# EAGLE schematic Schematic (EAGLE 7.4.0)
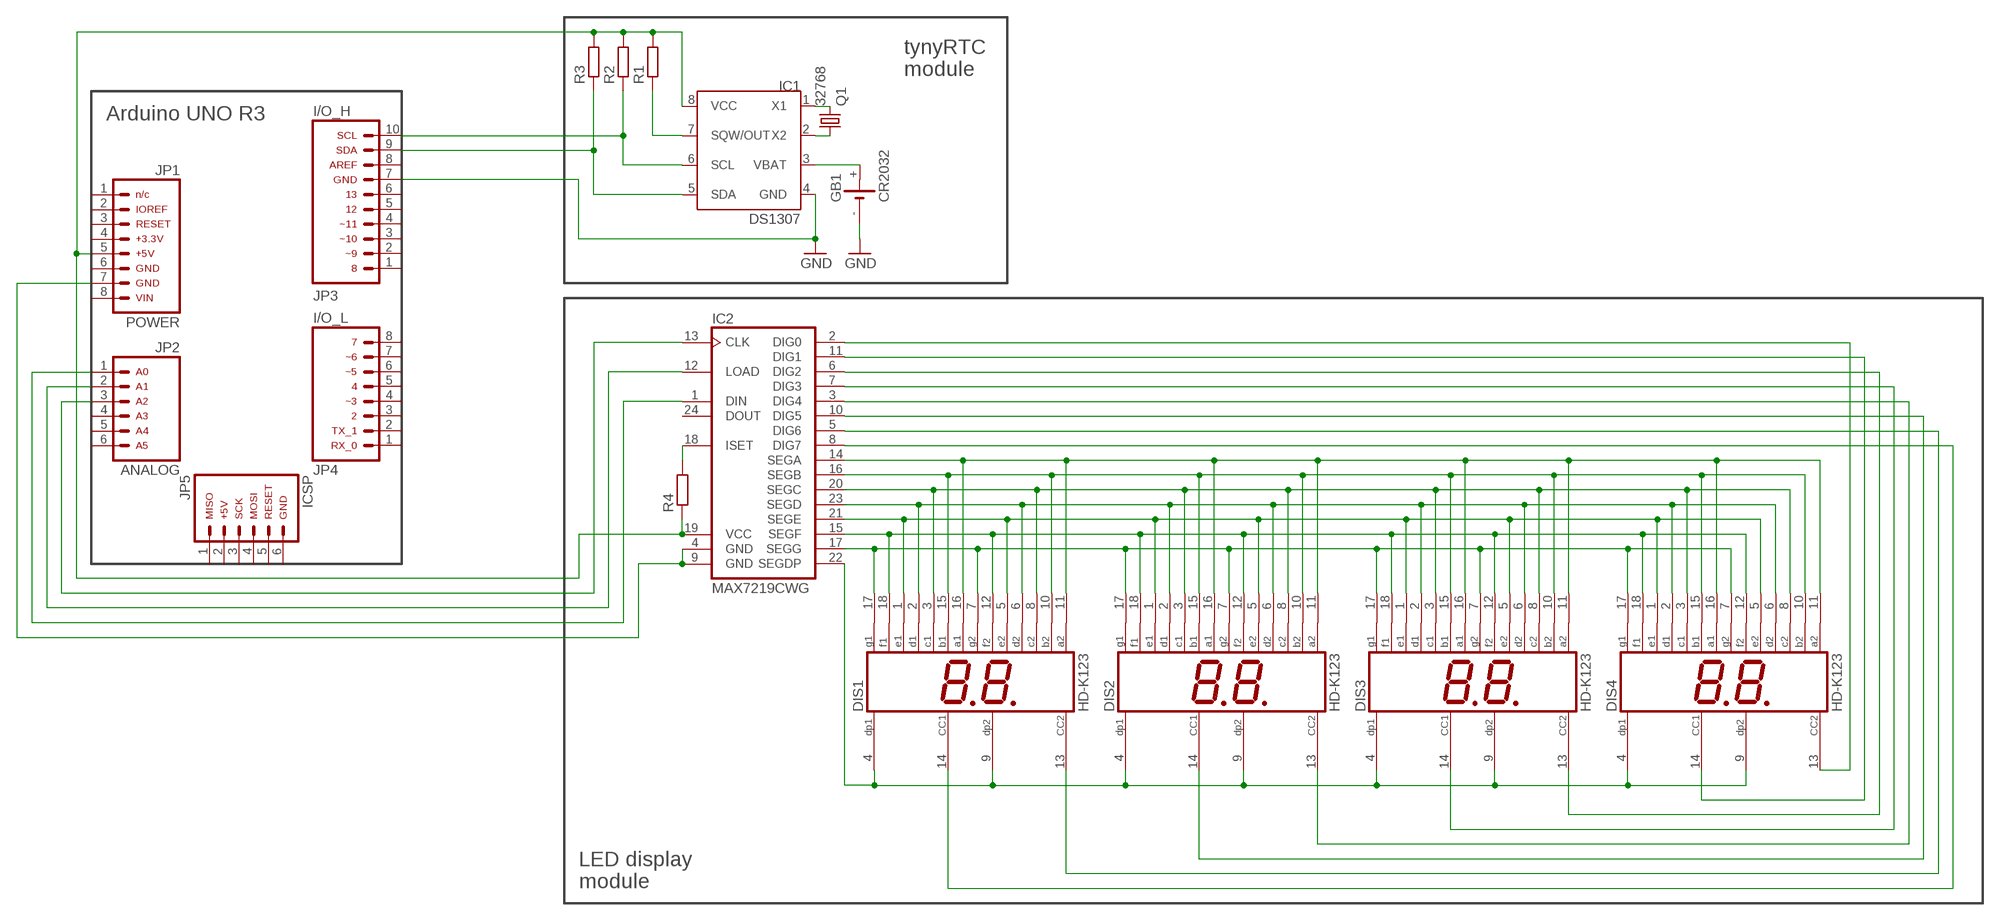
[diagram p0: schematic, sheet 1]

## Parts
DIS1  HD-K123  [HDSP-R]
DIS2  HD-K123  [HDSP-R]
DIS3  HD-K123  [HDSP-R]
DIS4  HD-K123  [HDSP-R]
GB1  CR2032  [CR2032]
IC1  DS1307  [SOIC-8]
IC2  MAX7219CWG  [SO24W]
JP1  ARDUINO_CONN-POWERSIP  [CONN-1X08]
JP2  ARDUINO_CONN-ANALOGSIP  [CONN-1X06]
JP3  ARDUINO_CONN-IO_HSIP  [CONN-1X10]
JP4  ARDUINO_CONN-IO_LSIP  [CONN-1X08]
JP5  ARDUINO_CONN-ICSP  [CONN-2X03]
Q1  32768  CRYSTALTC26H  [TC26H]
R1  R-EU_R0805  [R0805]
R2  R-EU_R0805  [R0805]
R3  R-EU_R0805  [R0805]
R4  R-EU_R0805  [R0805]

## Nets
GND: GB1.- IC1.4(GND) JP3.7
N$1: IC1.1(X1) Q1.2
N$2: IC1.2(X2) Q1.1
N$3: GB1.+ IC1.3(VBAT)
N$4: IC1.7(SQW/OUT) R1.1
N$5: IC1.6(SCL) JP3.10 R2.1
N$6: IC1.5(SDA) JP3.9 R3.1
N$7: DIS1.7(G2) DIS1.17(G1) DIS2.7(G2) DIS2.17(G1) DIS3.7(G2) DIS3.17(G1) DIS4.7(G2) DIS4.17(G1) IC2.17(SEGG)
N$8: IC2.1(DIN) JP2.1
N$9: IC2.12(LOAD) JP2.2
N$10: IC2.13(CLK) JP2.3
N$11: IC2.18(ISET) R4.2
N$12: DIS1.12(F2) DIS1.18(F1) DIS2.12(F2) DIS2.18(F1) DIS3.12(F2) DIS3.18(F1) DIS4.12(F2) DIS4.18(F1) IC2.15(SEGF)
N$13: IC2.4(GND) IC2.9(GND) JP1.7
N$14: IC1.8(VCC) IC2.19(VCC) JP1.5 R1.2 R2.2 R3.2 R4.1
N$15: DIS1.1(E1) DIS1.5(E2) DIS2.1(E1) DIS2.5(E2) DIS3.1(E1) DIS3.5(E2) DIS4.1(E1) DIS4.5(E2) IC2.21(SEGE)
N$16: DIS1.2(D1) DIS1.6(D2) DIS2.2(D1) DIS2.6(D2) DIS3.2(D1) DIS3.6(D2) DIS4.2(D1) DIS4.6(D2) IC2.23(SEGD)
N$17: DIS1.3(C1) DIS1.8(C2) DIS2.3(C1) DIS2.8(C2) DIS3.3(C1) DIS3.8(C2) DIS4.3(C1) DIS4.8(C2) IC2.20(SEGC)
N$18: DIS1.10(B2) DIS1.15(B1) DIS2.10(B2) DIS2.15(B1) DIS3.10(B2) DIS3.15(B1) DIS4.10(B2) DIS4.15(B1) IC2.16(SEGB)
N$19: DIS1.11(A2) DIS1.16(A1) DIS2.11(A2) DIS2.16(A1) DIS3.11(A2) DIS3.16(A1) DIS4.11(A2) DIS4.16(A1) IC2.14(SEGA)
N$20: DIS1.4(DP1) DIS1.9(DP2) DIS2.4(DP1) DIS2.9(DP2) DIS3.4(DP1) DIS3.9(DP2) DIS4.4(DP1) DIS4.9(DP2) IC2.22(SEGDP)
N$21: DIS4.13(CC2) IC2.2(DIG0)
N$22: DIS4.14(CC1) IC2.11(DIG1)
N$23: DIS3.13(CC2) IC2.6(DIG2)
N$24: DIS3.14(CC1) IC2.7(DIG3)
N$25: DIS2.13(CC2) IC2.3(DIG4)
N$26: DIS2.14(CC1) IC2.10(DIG5)
N$27: DIS1.13(CC2) IC2.5(DIG6)
N$28: DIS1.14(CC1) IC2.8(DIG7)
Unconnected: IC2.24(DOUT) JP1.1 JP1.2 JP1.3 JP1.4 JP1.6 JP1.8 JP2.4 JP2.5 JP2.6 JP3.1 JP3.2 JP3.3 JP3.4 JP3.5 JP3.6 JP3.8 JP4.1 JP4.2 JP4.3 JP4.4 JP4.5 JP4.6 JP4.7 JP4.8 JP5.1 JP5.2 JP5.3 JP5.4 JP5.5 JP5.6

## Notes on the sheet
- tynyRTC
  module
- Arduino UNO R3
- LED display
  module

## Library data of the parts
DIS1-DIS4 = display-hp:HD-K123: LED DISPLAY 2 x 1 character 7 segment, decimal points right; OC_FARNELL: unknown; OC_NEWARK: unknown
GB1 = battery1:CR2032
IC1 = dallas:DS1307: I2C Serial RTC w/56 bytes battery backed RAM
IC2 = maxim-5:MAX7219*: Serially Interfaced, 8-Digit LED Display Drivers
JP1 = arduino_jw:ARDUINO_CONN-POWER: Arduino Power Header This is the power header on the Arduino Uno R3. This connector is labeled with the following pin assignments: n/c IO Ref RESET +3.3V +5V GND GND VIN NOTE: Be sure you install this connector with the correct orientation on your PCB layout. Pin 1 has a square pad to assist with orientation.
JP2 = arduino_jw:ARDUINO_CONN-ANALOG: Arduino Analog I/O Header This is the analog I/O header on the Arduino Uno R3. This connector is labeled with the following pin assignments: Analog 0 Analog 1 Analog 2 Analog 3 Analog 4 Analog 5 NOTE: Be sure you install this connector with the correct orientation on your PCB layout. Pin 1 has a square pad to assist with orientation.
JP3 = arduino_jw:ARDUINO_CONN-IO_H: Arduino Digital I/O [High Byte] Header This is the Digital I/O [high byte] header on the Arduino Uno R3. This connector is labeled with the following pin assignments: Digital 8 Digital 9 [PWM] Digital 10 [PWM] Digital 11 [PWM] Digital 12 Digital 13 GND AREF SDA SCL NOTE: Be sure you install this connector with the correct orientation on your PCB layout. Pin 1 has a square pad to assist with orientation.
JP4 = arduino_jw:ARDUINO_CONN-IO_L: Arduino Digital I/O [Low Byte] Header This is the Digital I/O [low byte] header on the Arduino Uno R3. This connector is labeled with the following pin assignments: Digital 0, Serial Rx Digital 1, Serial Tx Digital 2 Digital 4 Digital 5 [PWM] Digital 6 [PWM] Digital 7 NOTE: Be sure you install this connector with the correct orientation on your PCB layout. Pin 1 has a square pad to assist with orientation.
JP5 = arduino_jw:ARDUINO_CONN-ICSP: Arduino ICSP I/O Header This is the ICSP I/O header on the Arduino Uno R3. This connector is labeled with the following pin assignments: MISO +5V SCK MOSI RESET GND NOTE: Be sure you install this connector with the correct orientation on your PCB layout. Pin 1 has a square pad to assist with orientation.
Q1 = crystal:CRYSTAL: CRYSTAL; OC_FARNELL: unknown; OC_NEWARK: unknown
R1-R4 = rcl:R-EU_: RESISTOR, European symbol